# Altium schematic sheet TM4C-B.SchDoc
size A4
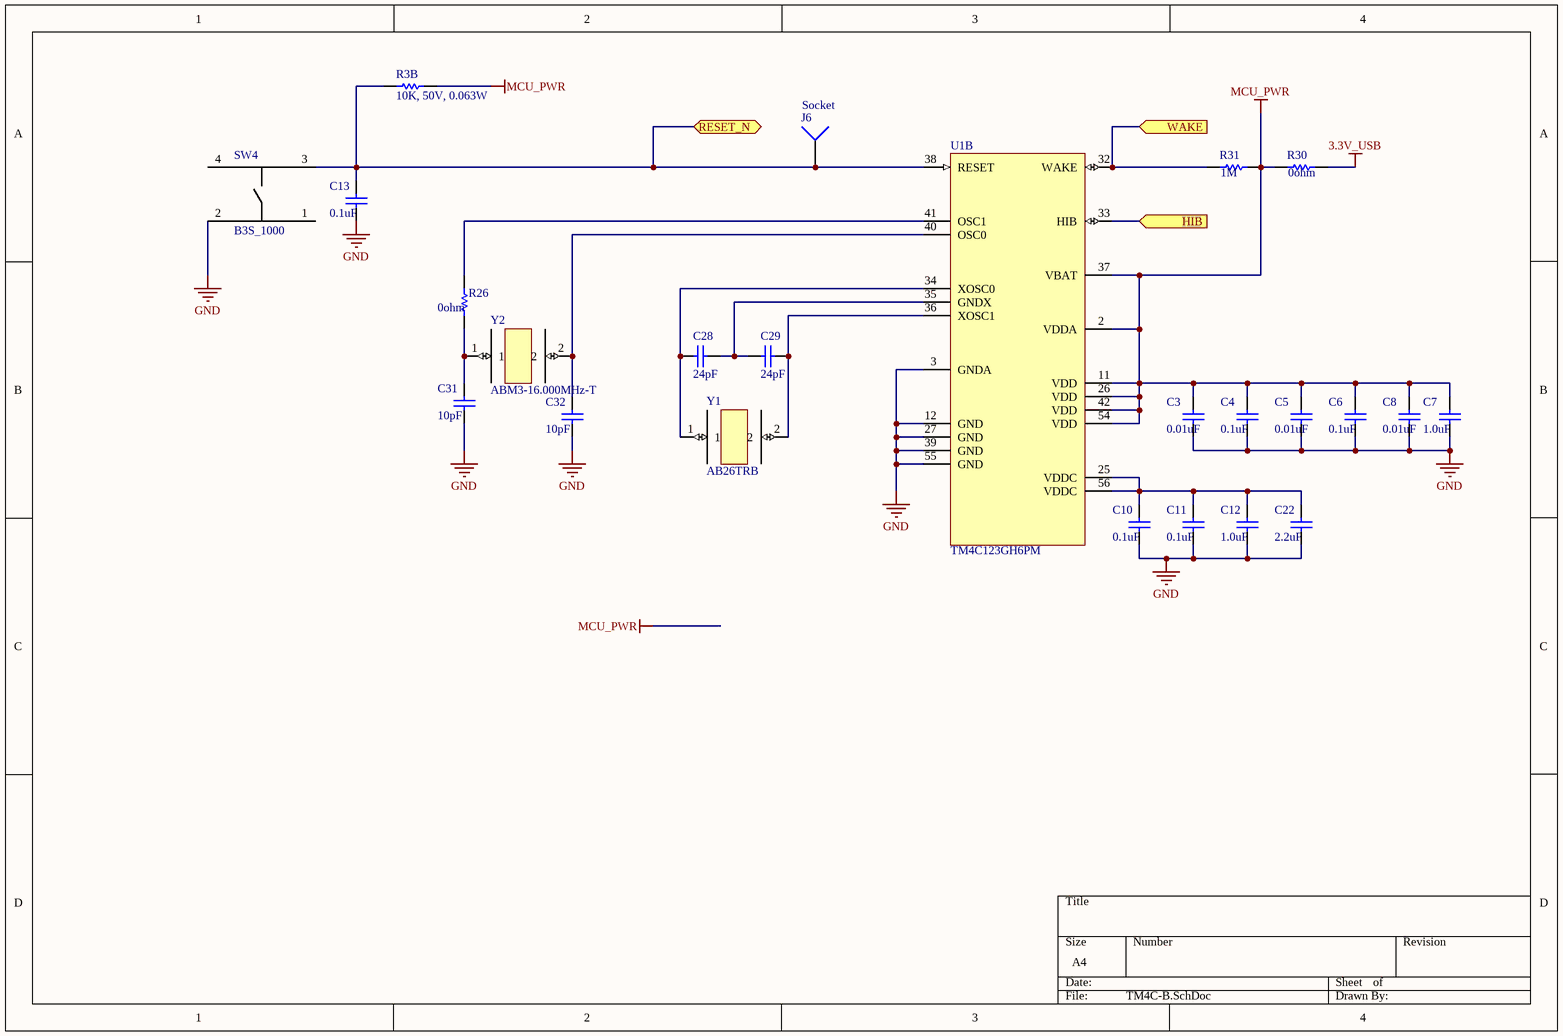
[diagram p0: TM4C-B.SchDoc]

## Parts
C3  0.01uF  [C0805]
C4  0.1uF  [C0805]
C5  0.01uF  [C0805]
C6  0.1uF  [C0805]
C7  1.0uF  [C0805]
C8  0.01uF  [C0805]
C10  0.1uF  [C0805]
C11  0.1uF  [C0805]
C12  1.0uF  [C0805]
C13  0.1uF  [C0805]
C22  2.2uF  [C0805]
C28  24pF  [C0805]
C29  24pF  [C0805]
C31  10pF  [C0805]
C32  10pF  [C0805]
J6  Socket  [PIN1]
R3B  10K, 50V, 0.063W  [ERA-0805]
R26  0ohm  [ERA-0805]
R30  0ohm  [ERA-0805]
R31  1M  [ERA-0805]
SW4  B3S_1000  [B3S_1000]
U1  TM4C123GH6PM  [LQFP64_L]  (part B of 2)
Y1  AB26TRB  [AB26TRB]
Y2  ABM3-16.000MHz-T  [ABM3]

## Ports
HIB (in), RESET_N (bidir), WAKE (in)

## Nets
3.3V_USB: R30.1
GND: C3.1 C4.1 C5.1 C6.1 C7.1 C8.1 C10.1 C11.1 C12.1 C13.1 C22.1 C31.1 C32.1 SW4.2 U1.3(GNDA) U1.12(GND) U1.27(GND) U1.39(GND) U1.55(GND)
MCU_PWR: C3.2 C4.2 C5.2 C6.2 C7.2 C8.2 R3B.1 R30.2 R31.1 U1.2(VDDA) U1.11(VDD) U1.26(VDD) U1.37(VBAT) U1.42(VDD) U1.54(VDD)
HIB: U1.33(HIB) ; port HIB
RESET_N: C13.2 J6.1 R3B.2 SW4.3 U1.38(RESET) ; port RESET_N
WAKE: R31.2 U1.32(WAKE) ; port WAKE
NetC10_2: C10.2 C11.2 C12.2 C22.2 U1.25(VDDC) U1.56(VDDC)
NetC28_1: C28.1 C29.2 U1.35(GNDX)
NetC28_2: C28.2 U1.34(XOSC0) Y1.1
NetC29_1: C29.1 U1.36(XOSC1) Y1.2
NetC31_2: C31.2 R26.1 Y2.1
NetC32_2: C32.2 U1.40(OSC0) Y2.2
NetR26_2: R26.2 U1.41(OSC1)

Not connected (* = marked no-connect by the designer): SW4 1 4

## Library data of the parts
C3-C8 C10-C13 C22 C28 C29 C31 C32 = Cap Semi: Capacitor (Semiconductor SIM Model); Published: 8-Jun-2000; LatestRevisionDate: 29-May-2009; LatestRevisionNote: IPC-7351 Footprint Added.; PackageReference: C1206; Publisher: Altium Limited; PackageDescription: Chip Capacitor
  C3 C5 C8: Value: 0.01uF
  C4 C6 C10 C11 C13: Value: 0.1uF
  C7 C12: Value: 1.0uF
  C22: Value: 2.2uF
  C28 C29: Value: 24pF
  C31 C32: Value: 10pF
R3B R26 R30 R31 = ERAS: Metal Film Thermosensitive Chip Resistor, 0.56 Ohm to 10k Ohm Range, 5% Tolerance, 0805 Size, 0.1 W; Note: If flow soldering, adjust pad width of PCB Footprint to 0.7 - 0.8 times the width of the resistor.; Published: 17-Dec-2003; LatestRevisionDate: 19-Mar-2004; LatestRevisionNote: Silkscreen size reduced.; PackageReference: ERA-0805; Publisher: Altium Limited; PackageDocument: Mar-2003; Code_IPC: 2012 [0805]; ComponentLink1Description: Manufacturer Link; ComponentLink1URL: http://www.panasonic.com/industrial/components/resistive_products.htm; ComponentLink2Description: Datasheet; ComponentLink2URL: http://www.panasonic.com/industrial/components/pdf/AOF0000CE1.pdf
Y2 = ABM3: Clock frq: 16MHz
J6 = Socket: LatestRevisionDate: 17-Jul-2002; LatestRevisionNote: Re-released for DXP Platform.; Publisher: Altium Limited